# Altium schematic sheet Multy_sheet.SchDoc
size A4
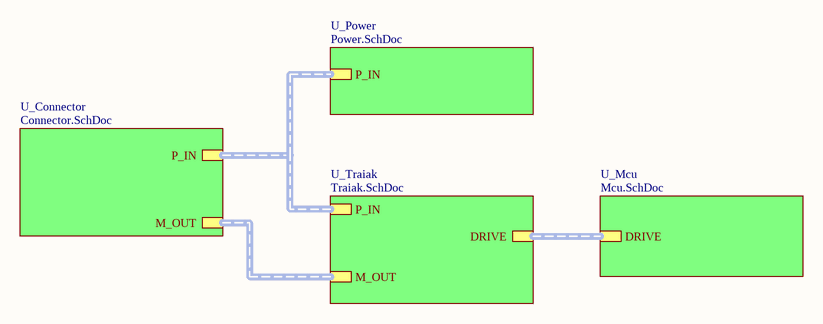
[diagram p0: Multy_sheet.SchDoc]

## Sub-sheets
U_Connector = Connector.SchDoc: P_IN (harness P_IN), M_OUT (harness M_OUT)
U_Mcu = Mcu.SchDoc: DRIVE (harness DRIVE)
U_Power = Power.SchDoc: P_IN (harness P_IN)
U_Traiak = Traiak.SchDoc: P_IN (harness P_IN), M_OUT (harness M_OUT), DRIVE (harness DRIVE)

## Buses and harness runs
harness sheet U_Connector/M_OUT = sheet U_Traiak/M_OUT
harness sheet U_Connector/P_IN = sheet U_Power/P_IN = sheet U_Traiak/P_IN
harness sheet U_Mcu/DRIVE = sheet U_Traiak/DRIVE

## Notes on the sheet
- Title
- Size:
- Date:
- A3
- Number:
- Time:
- Revision:
- Sheet
- of
- File: